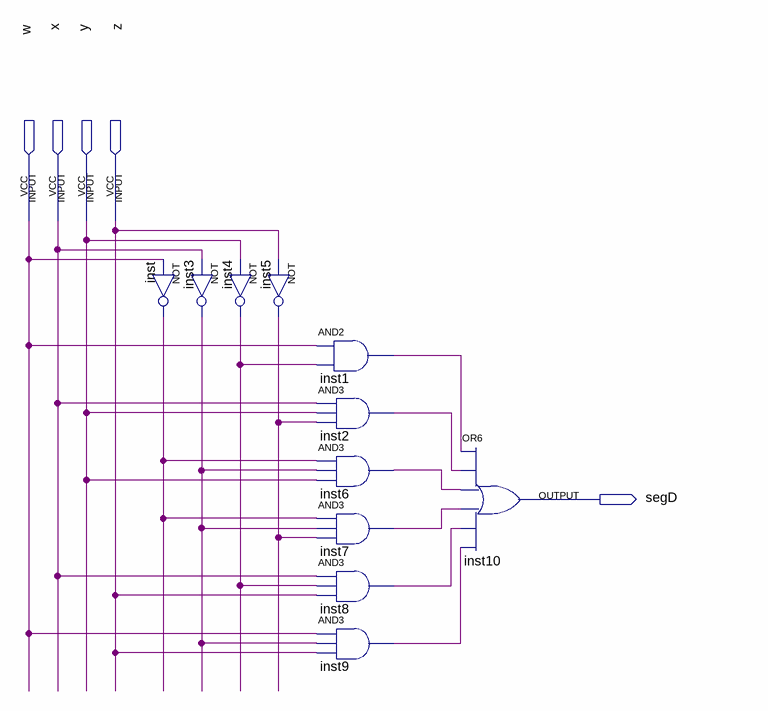
[diagram p0: schematic sheet]
// Quartus schematic segD.bdf as structural Verilog: 11 symbols, 5 pins
module segD (
  input  w,
  input  x,
  input  y,
  input  z,
  output segD
);

  wire inst1_out, inst2_out, inst3_out, inst4_out, inst5_out, inst6_out, inst7_out, inst8_out, inst9_out,
       inst_out;

  not inst (inst_out, w);
  not inst3 (inst3_out, x);
  not inst4 (inst4_out, y);
  not inst5 (inst5_out, z);
  and inst1 (inst1_out, w, inst4_out);
  and inst2 (inst2_out, x, y, inst5_out);
  and inst6 (inst6_out, inst_out, inst3_out, y);
  and inst7 (inst7_out, inst_out, inst3_out, inst5_out);
  and inst8 (inst8_out, x, inst4_out, z);
  and inst9 (inst9_out, w, inst3_out, z);
  or inst10 (segD, inst1_out, inst2_out, inst6_out, inst7_out, inst8_out, inst9_out);
endmodule
